# Altium schematic sheet MP_EOC_S9.SchDoc
size A4
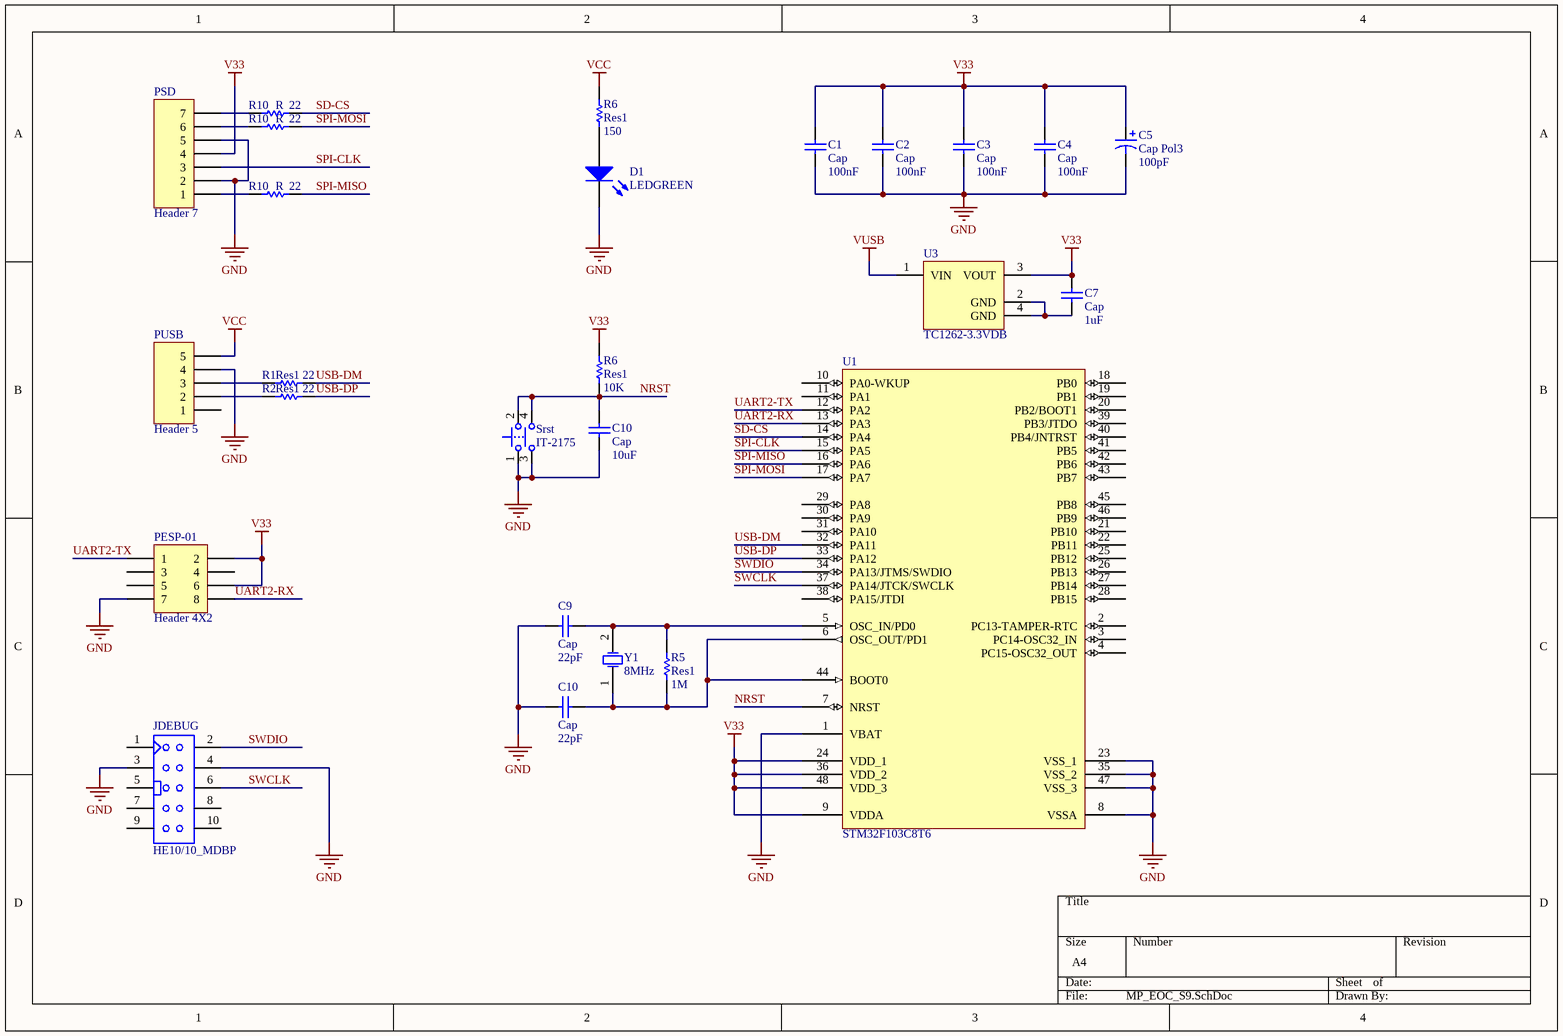
[diagram p0: MP_EOC_S9.SchDoc]

## Parts
(Parts that share a designator on the sheet are numbered #1, #2 ... from top to bottom, then left to right.)
C1  Cap  value 100nF  [RAD-0.3]
C2  Cap  value 100nF  [RAD-0.3]
C3  Cap  value 100nF  [RAD-0.3]
C4  Cap  value 100nF  [RAD-0.3]
C5  Cap Pol3  value 100pF  [C0805]
C7  Cap  value 1uF  [RAD-0.3]
C9  Cap  value 22pF  [RAD-0.3]
C10#1  Cap  value 10uF  [RAD-0.3]
C10#2  Cap  value 22pF  [RAD-0.3]
D1  LEDGREEN  [3.2X1.6X1.1]
JDEBUG  Type: HE10/10_MDBP  [HE10/10_M_D_BP]  (hidden comment: HE10/10_MALE_DROIT_BAS_PROFIL)
PESP-01  Header 4X2  [HDR2X4]
PSD  Header 7  [HDR1X7]
PUSB  Header 5  [HDR1X5]
R1  Res1  value 22  [AXIAL-0.3]
R2  Res1  value 22  [AXIAL-0.3]
R5  Res1  value 1M  [AXIAL-0.3]
R6#1  Res1  value 150  [AXIAL-0.3]
R6#2  Res1  value 10K  [AXIAL-0.3]
R10#1  R  value 22  [AXIAL-0.3]
R10#2  R  value 22  [AXIAL-0.3]
R10#3  R  value 22  [AXIAL-0.3]
Srst  IT-2175  [IT-2175]
U1  STM32F103C8T6  [LQFP48_N]
U3  TC1262-3.3VDB  [SOT-223-DB3_N]
Y1  8MHz  [R38]

## Nets
GND: C1.1 C2.1 C3.1 C4.1 C5.2 C9.1 C10#1.1 C10#2.1 D1.2(K) JDEBUG.3 JDEBUG.4 PESP-01.7 PSD.2 PSD.5 PUSB.4 Srst.1 Srst.3 U1.1(VBAT) U1.8(VSSA) U1.23(VSS_1) U1.35(VSS_2) U1.47(VSS_3)
V33: C1.2 C2.2 C3.2 C4.2 C5.1 C7.2 PESP-01.2 PESP-01.6 PSD.4 R6#2.2 U1.9(VDDA) U1.24(VDD_1) U1.36(VDD_2) U1.48(VDD_3) U3.3(VOUT)
VCC: PUSB.5 R6#1.2
VUSB: U3.1(VIN)
NRST: C10#1.2 R6#2.1 Srst.2 Srst.4 U1.7(NRST)
SD-CS: R10#1.2 U1.14(PA4)
SPI-CLK: PSD.3 U1.15(PA5)
SPI-MISO: R10#3.2 U1.16(PA6)
SPI-MOSI: R10#2.2 U1.17(PA7)
SWCLK: JDEBUG.6 U1.37(PA14/JTCK/SWCLK)
SWDIO: JDEBUG.2 U1.34(PA13/JTMS/SWDIO)
UART2-RX: PESP-01.8 U1.13(PA3)
UART2-TX: PESP-01.1 U1.12(PA2)
USB-DM: R1.2 U1.32(PA11)
USB-DP: R2.2 U1.33(PA12)
NetC7_1: C7.1 U3.2(GND) U3.4(GND)
NetC9_2: C9.2 R5.2 U1.5(OSC_IN/PD0) Y1.2(OSC2)
NetC10#2_2: C10#2.2 R5.1 U1.6(OSC_OUT/PD1) U1.44(BOOT0) Y1.1(OSC1)
NetD1_1: D1.1(A) R6#1.1
NetPSD_1: PSD.1 R10#3.1
NetPSD_6: PSD.6 R10#2.1
NetPSD_7: PSD.7 R10#1.1
NetPUSB_2: PUSB.2 R2.1
NetPUSB_3: PUSB.3 R1.1

Not connected (* = marked no-connect by the designer): JDEBUG 1 5 7 8 9 10; PESP-01 3 4 5; PUSB 1; U1 2(PC13-TAMPER-RTC) 3(PC14-OSC32_IN) 4(PC15-OSC32_OUT) 10(PA0-WKUP) 11(PA1) 18(PB0) 19(PB1) 20(PB2/BOOT1) 21(PB10) 22(PB11) 25(PB12) 26(PB13) 27(PB14) 28(PB15) 29(PA8) 30(PA9) 31(PA10) 38(PA15/JTDI) 39(PB3/JTDO) 40(PB4/JNTRST) 41(PB5) 42(PB6) 43(PB7) 45(PB8) 46(PB9)

## Library data of the parts
C1-C4 C7 C9 C10#1 C10#2 = Cap: Capacitor; Published: 8-Jun-2000; LatestRevisionDate: 17-Jul-2002; LatestRevisionNote: Re-released for DXP Platform.; PackageReference: RAD-0.3; Publisher: Altium Limited; PackageDescription: Radial Cap, Thru-Hole; 2 Leads; 0.3 in Pin Spacing
C5 = Cap Pol3: Polarized Capacitor (Surface Mount); Published: 8-Jun-2000; LatestRevisionDate: 29-May-2009; LatestRevisionNote: IPC-7351 Footprint Added.; PackageReference: C0805; Publisher: Altium Limited; PackageDescription: Chip Capacitor
D1 = LED2: Typical RED, GREEN, YELLOW, AMBER GaAs LED; Published: 8-Jun-2000; LatestRevisionDate: 17-Jul-2002; LatestRevisionNote: Re-released for DXP Platform.; PackageVersion: Feb-2002; PackageReference: 3.2X1.6X1.1; Publisher: Altium Limited; PackageDescription: SM LED; 2 Flat Leads
JDEBUG = HE10/10_MALE_DROIT_BAS_PROFIL: EMBASE HE10/10 MALE DROIT BAS PROFIL
PESP-01 = Header 4X2: Header, 4-Pin, Dual row; LatestRevisionDate: 17-Jul-2002; LatestRevisionNote: Re-released for DXP Platform.; Publisher: Altium Limited
PSD = Header 7: Header, 7-Pin; LatestRevisionDate: 17-Jul-2002; LatestRevisionNote: Re-released for DXP Platform.; Publisher: Altium Limited
PUSB = Header 5: Header, 5-Pin; LatestRevisionDate: 17-Jul-2002; LatestRevisionNote: Re-released for DXP Platform.; Publisher: Altium Limited
R1 R2 R5 R6#1 R6#2 R10#1-R10#3 = Res1: Resistor; Published: 8-Jun-2000; LatestRevisionDate: 17-Jul-2002; LatestRevisionNote: Re-released for DXP Platform.; PackageReference: AXIAL-0.3; Publisher: Altium Limited; PackageDescription: Axial Device, Thru-Hole; 2 Leads; 0.3 in Pin Spacing
Srst = IT-2175: Tactile Switch, DPST; Thru-Hole; Vertical; Rating DC 12V, 50mA (max); PackageDocument: Rev.0; Published: 6-Jun-2005; DatasheetDocument: Rev.0; PackageReference: IT-2175; Publisher: Altium Limited; ComponentLink1Description: Manufacturer Link; ComponentLink1URL: http://www.ilswitch.com/; ComponentLink2Description: Device Overview; ComponentLink2URL: http://www.ilswitch.com/list.php?ac_id=010112&ai_id=91
U1 = STM32F103C8T6: STM32 ARM-based 32-bit MCU with 64 Kbytes Flash, 48-pin LQFP, Industrial Temperature; Published: 30-May-2008; DatasheetVersion: rev6, Mar-2008; PackageVersion: Mar-2008; PackageReference: LQFP48; Publisher: Altium Limited; PackageDescription: 48-Pin Low-Profile Quad Flat Pack, 7 x 7 mm Body, 0.5 mm Pitch (LQFP48); ComponentLink1Description: Manufacturer Link; ComponentLink1URL: www.st.com/stm32; ComponentLink2Description: Datasheet; ComponentLink2URL: http://www.st.com/stonline/products/literature/ds/13587.pdf
U3 = TC1262-3.3VDB: 500mA Fixed Output CMOS LDO, 3-Pin SOT-223, Extended Temperature; Published: 29-Jan-2009; DatasheetVersion: revB, 2002; PackageVersion: revAW, Oct-2008; PackageReference: SOT-223-DB3; Publisher: Altium Limited; PackageDescription: 3-Lead Plastic Small Outline Transistor (DB) [SOT-223]; ComponentLink1Description: Manufacturer Link; ComponentLink1URL: http://www.microchip.com; ComponentLink2Description: Datasheet; ComponentLink2URL: http://ww1.microchip.com/downloads/en/DeviceDoc/21373b.pdf; ComponentLink3Description: Packaging Specification; ComponentLink3URL: http://ww1.microchip.com/downloads/en/PackagingSpec/00049AW.pdf
Y1 = XTAL: Crystal Oscillator; Published: 8-Jun-2000; LatestRevisionDate: 17-Jul-2002; LatestRevisionNote: Re-released for DXP Platform.; PackageReference: R38; Publisher: Altium Limited; PackageDescription: Crystal, Thru-Hole; 2 Leads; Body 3.1 x 8.2 mm (Dia.xH)